# EAGLE design Tiefenentladeschutz-addon (EAGLE 7.5.0)
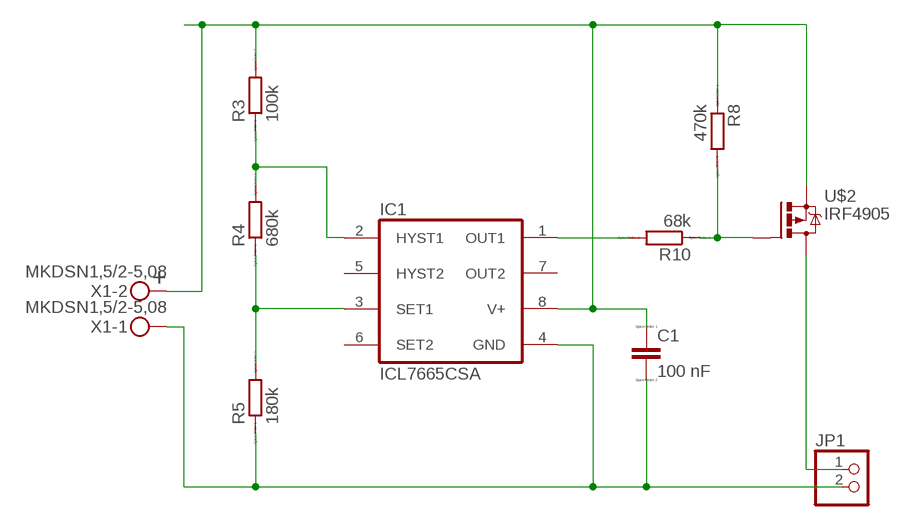
[diagram p0: schematic, sheet 1]

## Parts
C1  100 nF  CC0603  [C0603]
IC1  ICL7665CSA  [SO08]
JP1  PINHD-1X2  [1X02]
R3  100k  RR1206  [R1206]
R4  680k  RR1206  [R1206]
R5  180k  RR1206  [R1206]
R8  470k  RR1206  [R1206]
R10  68k  RR1206  [R1206]
U$2  IRF4905  [TO220BH]
X1  MKDSN1,5/2-5,08  [MKDSN1,5/2-5,08]

## Nets
GND: C1.2 IC1.4(GND) JP1.2 R5.1 X1.1
N$2: IC1.3(SET1) R4.1 R5.2
N$7: R8.2 R10.1 U$2.G
N$13: IC1.2(HYST1) R3.1 R4.2
N$16: IC1.1(OUT1) R10.2
N$22: JP1.1 U$2.D
V+: C1.1 IC1.8(V+) R3.2 R8.1 U$2.S X1.2
Unconnected: IC1.5(HYST2) IC1.6(SET2) IC1.7(OUT2)

## Notes on the sheet
- +

## Library data of the parts
C1 = eagle-ltspice:C: CAPACITOR, European symbol; SPICEMODEL: NONE; SPICEPREFIX: C
IC1 = maxim:ICL7665CSA: UNDER/OVER VOLTAGE DETECTOR; MPN: ICL7665CSA+; OC_FARNELL: unknown; OC_NEWARK: 19M9537
JP1 = pinhead:PINHD-1X2: PIN HEADER
R3-R5 R8 R10 = eagle-ltspice:R: RESISTOR, European symbol; SPICEMODEL: NONE; SPICEPREFIX: R
U$2 = transistor-power:IRF4905: P-Channel HEXFET® Power MOSFET RDS(on)= 0.02 Ohm, ID = -74A Source: http://www.irf.com/product-info/datasheets/data/irf4905pbf.pdf
X1 = con-phoenix-508:MKDSN1,5/2-5,08: MKDSN 1,5/ 2-5,08 Printklemme Nennstrom: 13,5 A Nennspannung: 250 V Rastermaß: 5,08 mm Polzahl: 2 Anschlussart: Schraubanschluss Montage: Löten Anschlussrichtung Leiter/Platine: 0 ° Artikelnummer: 1729128 Source: http://eshop.phoenixcontact.com .. 1729128.pdf

## Board
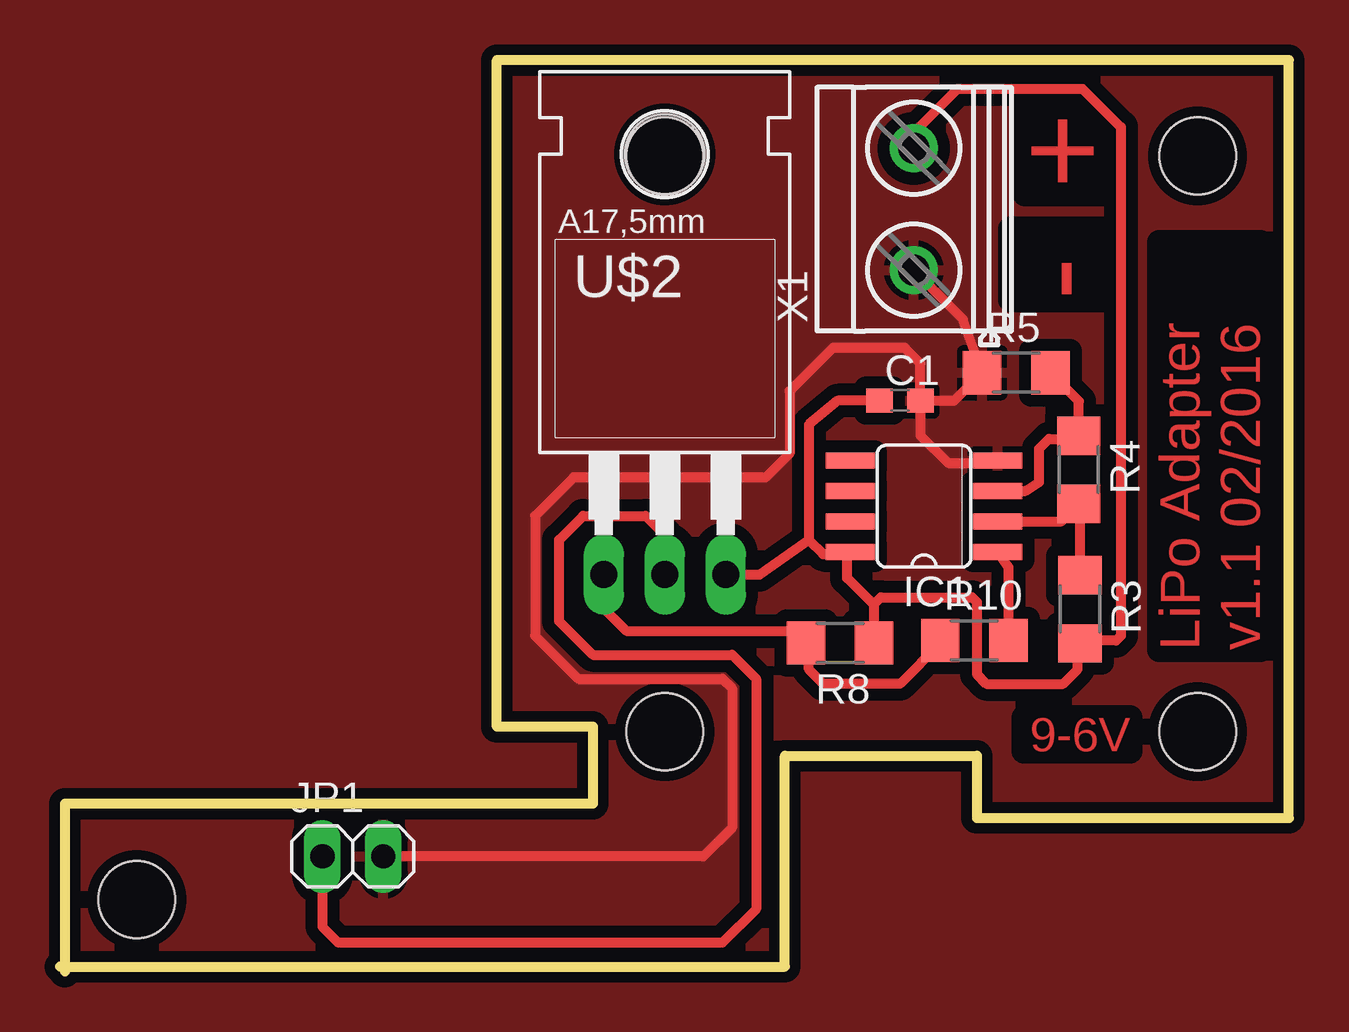
[diagram p1: board, top side]

Size 51.2 x 38 mm. Coordinates in mm from the lower left corner, seen from the top.
Outline: 0,0.2 30.2,0.2 30.2,9 38.2,9 38.2,6.4 51.2,6.4 51.2,38 18.2,38 18.2,10.2 22.2,10.2 22.2,7 0.2,7 0.2,0
Copper layers (1*16): Top 0.035mm / dielectric 1.5mm / Bottom 0.035mm
Design rules "default *": minimum track width 14mil, minimum drill 24mil, track to track 20mil, track to pad 20mil, pad to pad 20mil, via to via 20mil, smd to smd 8mil, copper to edge 18mil, drill to drill 18mil, minimum pad ring 10mil, minimum via ring 8mil, stop-mask expansion 4mil, vias tented up to drill 0mil, thermal gap 10mil
Holes 3.2 mm at 3.2,3 25.2,10 25.2,34 47.4,34 47.4,10

### Footprints (pad centres in the part's own frame; a part is rotated, then mirrored left to right if it is on the bottom)
C0603 = smd 1.1 x 1: 1 -0.85,0; 2 0.85,0
SO08 = smd 0.66 x 2.032: 1 -1.905,-3.073; 2 -0.635,-3.073; 3 0.635,-3.073; 4 1.905,-3.073; 5 1.905,3.073; 6 0.635,3.073; 7 -0.635,3.073; 8 -1.905,3.073
1X02 = drill 1.016 long: 1 -1.27,0; 2 1.27,0
R1206 = smd 1.6 x 1.803: 1 -1.422,0; 2 1.422,0
TO220BH = drill 1.118 long: D 0,-6.35; G -2.54,-6.35; S 2.54,-6.35 | hole 3.302: 0,11.176
MKDSN1,5/2-5,08 = drill 1.3 pad 2: 1 -2.561,0.025; 2 2.519,0.025

### Placement (x,y rotation side)
C1  35,23.8 0 top
IC1  36,19.4 90 top
JP1  12.2,4.8 0 top
R3  42.5,15.1 270 top
R4  42.45,20.92 270 top
R5  39.84,24.96 0 top
R8  32.5,13.7 180 top
R10  38.1,13.8 0 top
U$2  25.2,22.9 0 top
X1  35.6,31.8 90 top

### Tracks (layer width: path | path; a pad name or v marks a point on that pad's centre or on a via)
GND
  Top 0.406: C1.2 37.26,23.8 R5.1 37.62,27.19 X1.1 | C1.2 35.85,22.35 37,21.2 38.77,21.2 IC1.4 | C1.2 35.85,25.35 35.2,26 32.2,26 30.4,24.2 30.4,21.6 29.4,20.6 21.4,20.6 19.8,19 19.8,14 21.6,12.2 27.6,12.2 28,11.8 28,6 26.8,4.8 JP1.2
  pour Top: -9.8,41.6 56.4,41.6 56.4,-4.2 -9.8,-4.2
N$1
  pour Top: -11.8,43.2 58.8,43.2 58.8,-6 -11.8,-6
N$2
  Top 0.406: IC1.3 40.23,20.04 40.8,20.4 40.8,21.8 41.2,22.2 42.31,22.2 R4.1 42.45,23.77 R5.2
N$7
  Top 0.406: R10.1 36.68,13.68 35,12 31.8,12 31.2,12.6 31.2,13.58 R8.2 30.58,14.2 23.6,14.2 22.66,15.14 U$2.G
N$13
  Top 0.406: IC1.2 41.72,18.77 R4.2 42.5,19.45 R3.1
N$16
  Top 0.406: R10.2 39.52,16.85 IC1.1
N$22
  Top 0.406: JP1.1 10.93,1.87 11.6,1.2 27.6,1.2 29,2.6 29,12.2 28,13.2 22.2,13.2 20.8,14.6 20.8,18 21.8,19 24.4,19 25.2,18.2 U$2.D 25.2,15.4
V+
  Top 0.406: C1.1 32.4,23.8 31.2,22.8 31.2,18 | 31.2,18 31.8,17.4 32.63,17.4 IC1.8 32.8,17.42 32.8,16.4 33.92,15.28 R8.1 33.92,15.32 34.2,15.6 38,15.6 38.2,15.4 38.2,12.4 38.6,12 41.8,12 42.4,12.6 42.4,13.58 R3.2 42.62,13.8 44,13.8 44.2,14 44.2,35.2 42.6,36.8 37.4,36.8 35.58,34.98 X1.2 | U$2.S 29.15,16.55 31.2,18

### Text on the board
Top: Monopoly LiPo Adapter / mit Tiefenentladeschutz bei 6.2V / V 1.1 02/2017 | + | - | LiPo Adapter / v1.1 02/2016 | 9-6V